# Altium schematic sheet Redresseur.SchDoc
size A4; SheetNumber: 4; SheetTotal: 4; SPICEModelCacheVOTUBUYG: <root> / <DocumentId>VOTUBUYG</DocumentId> / <CacheFrame Number="0"> / <Model Name="ideal" Kind="CKT"> / <Text>*IDEAL:Amplificateur operationnel avec gain boucle ouverte de 100K / .SUBCKT IDEAL 1 2 3 / EGAIN 3 0 1 2 1E5 / .ENDS</Text> / </Model> / </CacheFrame> / </root>
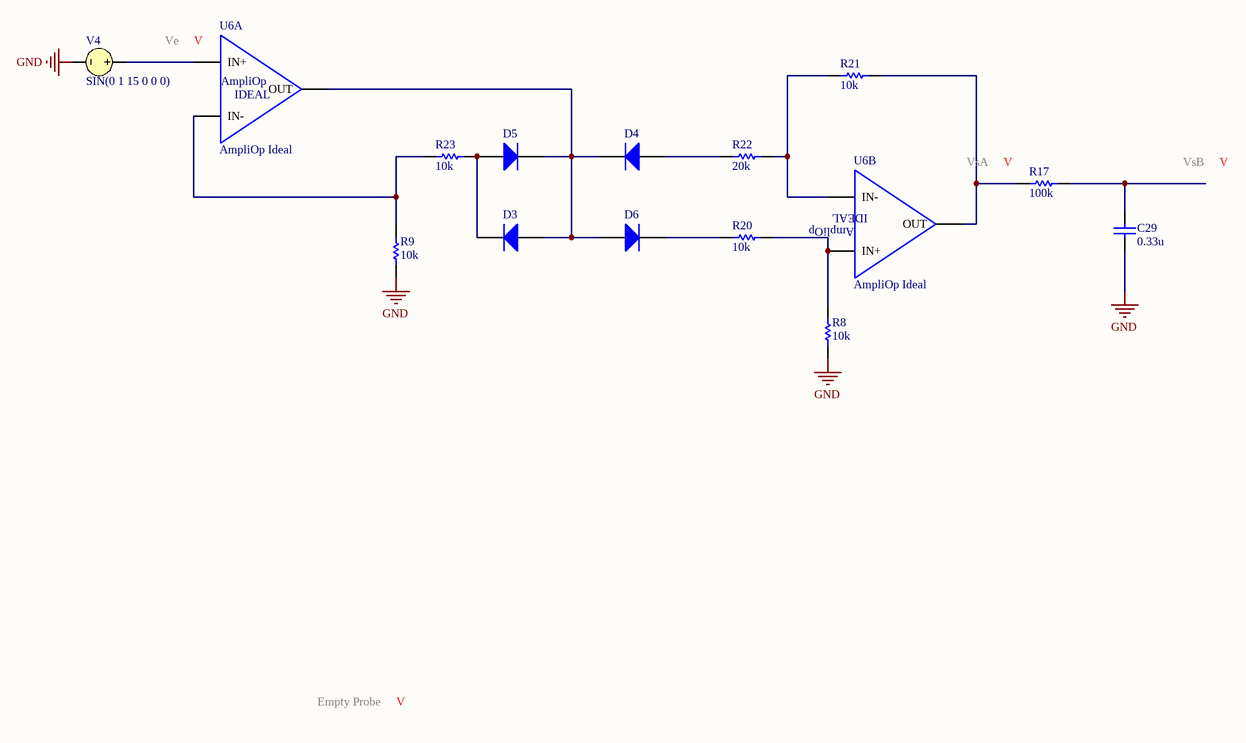
[diagram p0: Redresseur.SchDoc]

## Parts
C29  value 0.33u  (hidden comment: Capacitor)
D3  Diode  (value not drawn)
D4  Diode  (value not drawn)
D5  Diode  (value not drawn)
D6  Diode  (value not drawn)
R8  value 10k  (hidden comment: Resistor)
R9  value 10k  (hidden comment: Resistor)
R17  value 100k  (hidden comment: Resistor)
R20  value 10k  (hidden comment: Resistor)
R21  value 10k  (hidden comment: Resistor)
R22  value 20k  (hidden comment: Resistor)
R23  value 10k  (hidden comment: Resistor)
U6A  AmpliOp Ideal
U6B  AmpliOp Ideal
V4  SIN(0 1 15 0 0 0)

## Nets
GND: C29.1 R8.1 R9.1 V4.2
NetC29_2: C29.2 R17.2
NetD3_1: D3.1(A) D4.2(K) D5.2(K) D6.1(A) U6A.3(OUT)
NetD3_2: D3.2(K) D5.1(A) R23.2
NetD4_1: D4.1(A) R22.1
NetD6_2: D6.2(K) R20.1
NetR8_2: R8.2 R20.2 U6B.1(IN+)
NetR9_2: R9.2 R23.1 U6A.2(IN-)
NetR17_1: R17.1 R21.2 U6B.3(OUT)
NetR21_1: R21.1 R22.2 U6B.2(IN-)
NetU6A_1: U6A.1(IN+) V4.1

## Notes on the sheet
- (in symbol AmpliOp_ideal) AmpliOp; IDEAL

## Library data of the parts
C29 = Capacitor: SimulationGenericComponent: True
D3-D6 = Diode: AF: 1; BV: 0; BV_MAX: 1e99; EG: 1.11; FC: 0.5; IBV: 0.001; ISR: 1e-14; MJSW: 0.33; NTUN: 30; TNOM: 27; XTI: 3; SimulationGenericComponent: True; CJO: 0; CJP: 0; CTA: 0; CTP: 0; FCS: 0.5; FV_MAX: 1e99; IKF: 0; IKR: 0; JSW: 0; JTUN: 0; JTUNSW: 0; KEG: 1; KF: 0; LEVEL: 1; N: 1; NBV: 1; NR: 1; NS: 1; PHP: 1; RS: 0; TCV: 0; TLEV: 0; TLEVC: 0; TM1: 0; TM2: 0; TPB: 0; TPHP: 0; TRS: 0; TRS2: 0; TT: 0; TTT1: 0; TTT2: 0; VJ: 1; XTITUN: 3; IS: 1e-14
R8 R9 R17 R20-R23 = Resistor: TC1: 0; SimulationGenericComponent: True; TC2: 0
U6A U6B = AmpliOp_ideal
V4 = VSRC: Voltage Source; Note: PCB Footprint - Not required; AC Magnitude: 0; Amplitude: 1; Frequency: 15; Published: 8-Jun-2000; LatestRevisionDate: 17-Jul-2002; LatestRevisionNote: Re-released for DXP Platform.; PackageReference: Not Applicable; Publisher: Altium Limited; AC Phase: 0; DC Magnitude: 0; Offset: 0; Delay: 0; Damping Factor: 0; Phase: 0